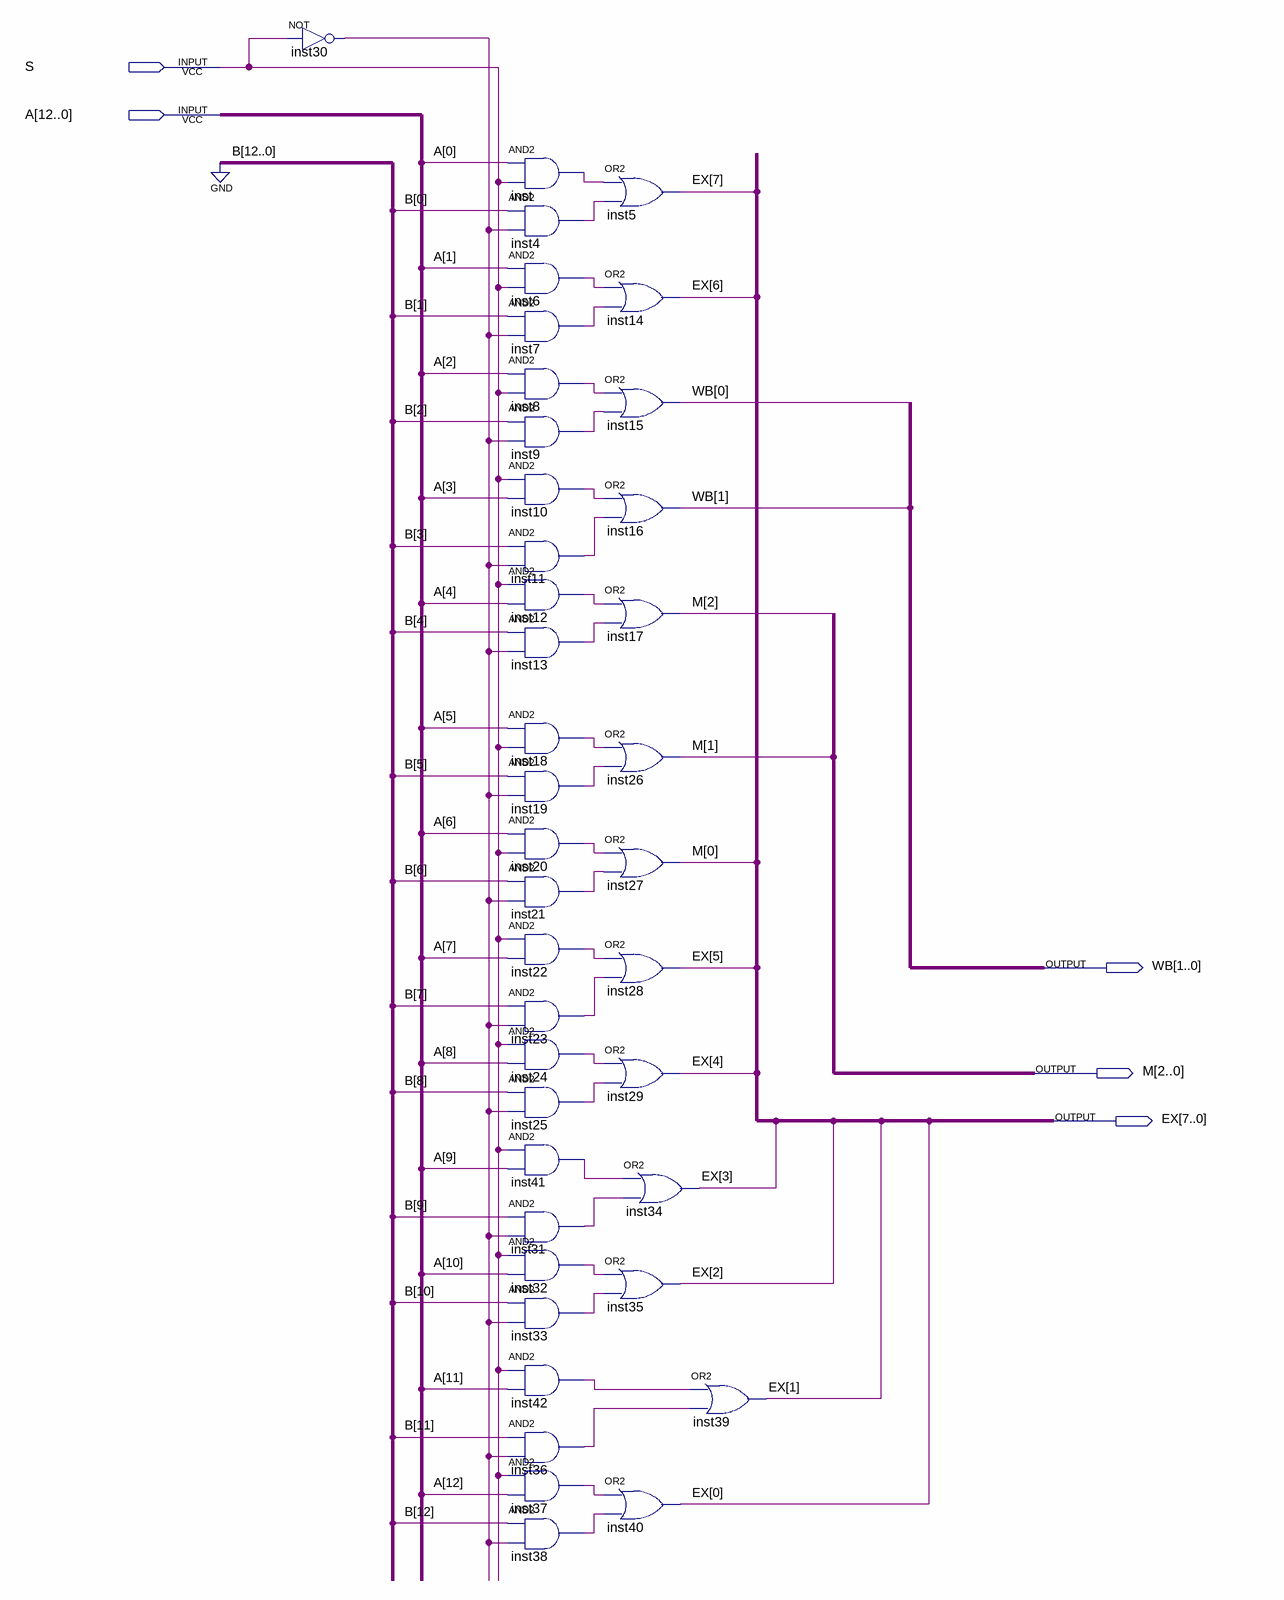
[diagram p0: schematic sheet]
// Quartus schematic MUX2X1_9bits.bdf as structural Verilog: 40 symbols, 5 pins
module MUX2X1_9bits (
  input  S,
  input  [12:0] A,
  output [1:0] WB,
  output [2:0] M,
  output [7:0] EX
);

  wire inst4_out, inst6_out, inst7_out, inst8_out, inst9_out, inst10_out, inst11_out, inst12_out, inst13_out,
       inst18_out, inst19_out, inst20_out, inst21_out, inst22_out, inst23_out, inst24_out, inst25_out,
       inst30_out, inst31_out, inst32_out, inst33_out, inst36_out, inst37_out, inst38_out, inst41_out,
       inst42_out, inst_out;

  not inst30 (inst30_out, S);
  and inst (inst_out, A[0], S);
  and inst4 (inst4_out, 1'b0, inst30_out);
  and inst6 (inst6_out, A[1], S);
  and inst7 (inst7_out, 1'b0, inst30_out);
  and inst8 (inst8_out, A[2], S);
  and inst9 (inst9_out, 1'b0, inst30_out);
  and inst10 (inst10_out, S, A[3]);
  and inst11 (inst11_out, 1'b0, inst30_out);
  and inst12 (inst12_out, S, A[4]);
  and inst13 (inst13_out, 1'b0, inst30_out);
  and inst18 (inst18_out, A[5], S);
  and inst19 (inst19_out, 1'b0, inst30_out);
  and inst20 (inst20_out, A[6], S);
  and inst21 (inst21_out, 1'b0, inst30_out);
  and inst22 (inst22_out, S, A[7]);
  and inst23 (inst23_out, 1'b0, inst30_out);
  and inst24 (inst24_out, S, A[8]);
  and inst25 (inst25_out, 1'b0, inst30_out);
  and inst41 (inst41_out, S, A[9]);
  and inst31 (inst31_out, 1'b0, inst30_out);
  and inst32 (inst32_out, S, A[10]);
  and inst33 (inst33_out, 1'b0, inst30_out);
  and inst42 (inst42_out, S, A[11]);
  and inst36 (inst36_out, 1'b0, inst30_out);
  and inst37 (inst37_out, S, A[12]);
  and inst38 (inst38_out, 1'b0, inst30_out);
  or inst5 (EX[7], inst_out, inst4_out);
  or inst14 (EX[6], inst6_out, inst7_out);
  or inst15 (WB[0], inst8_out, inst9_out);
  or inst16 (WB[1], inst10_out, inst11_out);
  or inst17 (M[2], inst12_out, inst13_out);
  or inst26 (M[1], inst18_out, inst19_out);
  or inst27 (M[0], inst20_out, inst21_out);
  or inst28 (EX[5], inst22_out, inst23_out);
  or inst29 (EX[4], inst24_out, inst25_out);
  or inst34 (EX[3], inst41_out, inst31_out);
  or inst35 (EX[2], inst32_out, inst33_out);
  or inst40 (EX[0], inst37_out, inst38_out);
  or inst39 (EX[1], inst42_out, inst36_out);
endmodule
